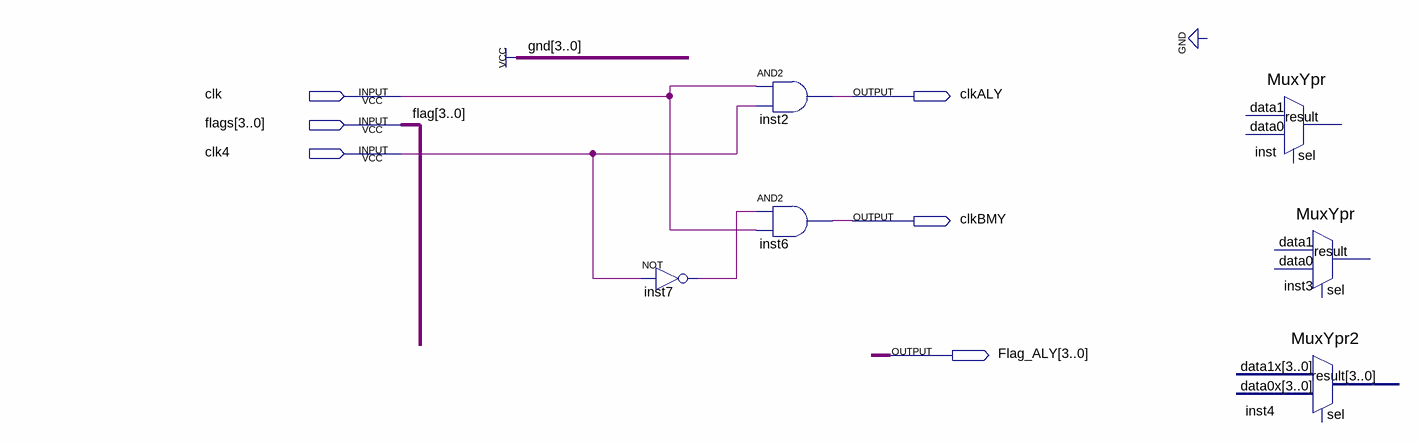
[diagram p0: schematic sheet]
// Quartus schematic exemple.bdf as structural Verilog: 6 symbols, 6 pins
module exemple (
  input  clk,
  input  [3:0] flags,
  input  clk4,
  output clkALY,
  output clkBMY,
  output [3:0] Flag_ALY
);

  wire inst7_out;

  not inst7 (inst7_out, clk4);
  and inst2 (clkALY, clk, clk4);
  and inst6 (clkBMY, inst7_out, clk);
  MuxYpr inst ();  // open: data1, data0, sel, result
  MuxYpr2 inst4 ();  // open: data1x, data0x, sel, result
  MuxYpr inst3 ();  // open: data1, data0, sel, result

  // Other names for the same wires on the sheet: flag[3:0] = flags
endmodule
